# Altium schematic sheet MCU_Top.SchDoc
size A4
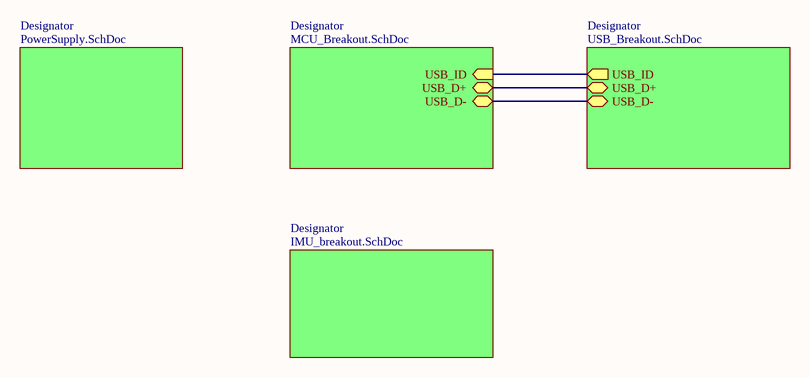
[diagram p0: MCU_Top.SchDoc]

## Sub-sheets
Designator = MCU_Breakout.SchDoc: USB_ID (in), USB_D+ (bidir), USB_D- (bidir)
Designator = USB_Breakout.SchDoc: USB_ID (out), USB_D+ (bidir), USB_D- (bidir)
Designator = IMU_breakout.SchDoc: no entries
Designator = PowerSupply.SchDoc: no entries

## Nets
(unnamed): sheet Designator/USB_ID, sheet Designator/USB_ID
(unnamed): sheet Designator/USB_D+, sheet Designator/USB_D+
(unnamed): sheet Designator/USB_D-, sheet Designator/USB_D-